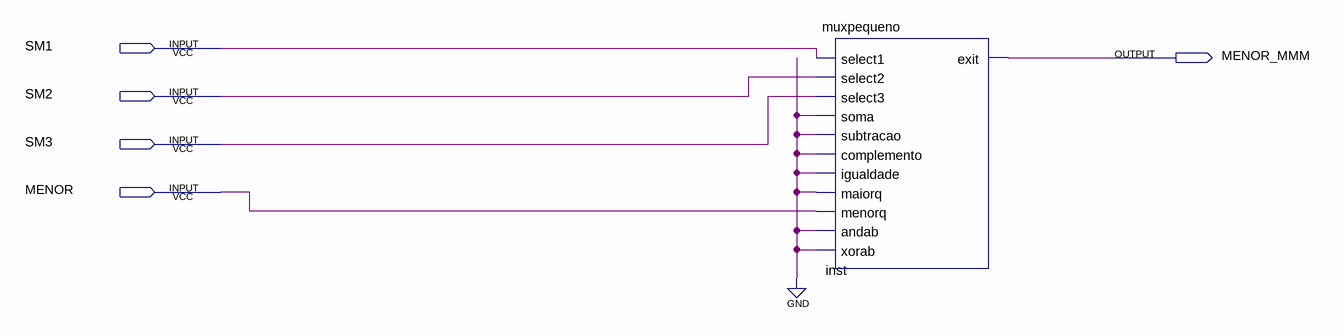
[diagram p0: schematic sheet]
// Quartus schematic MUXMENOR_QUE.bdf as structural Verilog: 1 symbols, 5 pins
module MUXMENOR_QUE (
  input  SM1,
  input  SM2,
  input  SM3,
  input  MENOR,
  output MENOR_MMM
);

  muxpequeno inst (
    .select1(SM1), .select2(SM2), .select3(SM3), .soma(1'b0), .subtracao(1'b0), .complemento(1'b0),
    .igualdade(1'b0), .maiorq(1'b0), .menorq(MENOR), .andab(1'b0), .xorab(1'b0), .exit(MENOR_MMM));
endmodule
